# Altium project Tank.PrjPcb
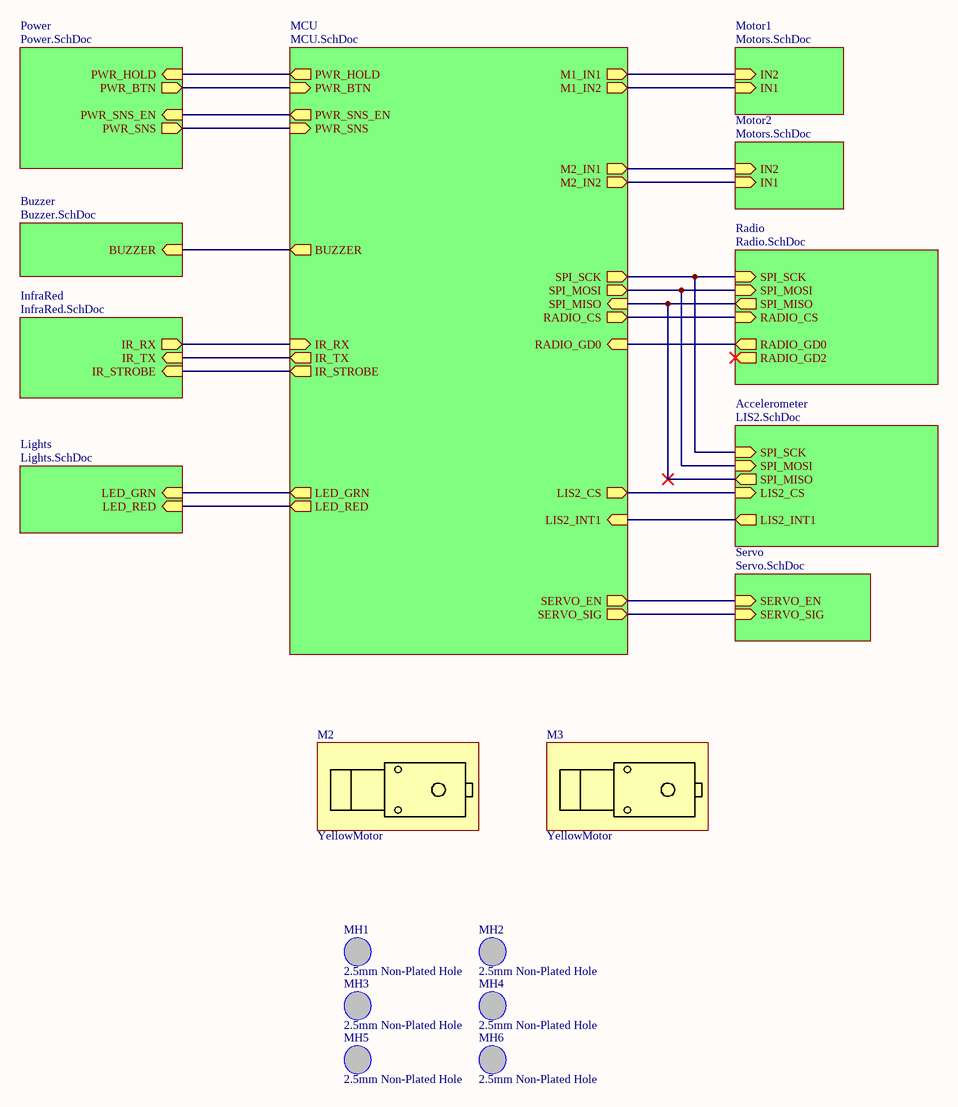
[diagram p0: Top.SchDoc]
Project_Revision: 1.0; Project_Board_Name: A7V Tank
10 sheets, 99 parts. Net scope: hierarchical (ports join the sheet entries above them; power ports are global).
Board file: Tank.PcbDoc
Sheets:
  Top.SchDoc
    Motor1 = Motors.SchDoc
    Motor2 = Motors.SchDoc
    Radio = Radio.SchDoc
    Power = Power.SchDoc
    MCU = MCU.SchDoc
    Servo = Servo.SchDoc
    Accelerometer = LIS2.SchDoc
    Buzzer = Buzzer.SchDoc
    InfraRed = InfraRed.SchDoc
    Lights = Lights.SchDoc

## Sheet Top.SchDoc: Top Level
size A3; CompanyName: NOT USED; DocumentNumber: 10; SheetNumber: 10; SheetTotal: 10; PageSetup: Record=PageOptions|CenterHorizontal=True|CenterVertical=True|PrintScale=1.00|XCorrection=1.00|YCorrection=1.00|PrintKind=0|BorderSize=5000000|LeftOffset=0|BottomOffset=0|Orientation=2|PaperLength=1000|PaperWidth=1000|Scale=100|PaperSource=7|PrintQuality=-4|MediaType=1|DitherType=10|PaperKind=A3|PrintScaleMode=0

### Parts
M2  YellowMotor  [YELLOW_MOTOR]
M3  YellowMotor  [YELLOW_MOTOR]
MH1  2.5mm Non-Plated Hole  [MTG250X550]  (no BOM)
MH2  2.5mm Non-Plated Hole  [MTG250X550]  (no BOM)
MH3  2.5mm Non-Plated Hole  [MTG250X550]  (no BOM)
MH4  2.5mm Non-Plated Hole  [MTG250X550]  (no BOM)
MH5  2.5mm Non-Plated Hole  [MTG250X550]  (no BOM)
MH6  2.5mm Non-Plated Hole  [MTG250X550]  (no BOM)

### Sub-sheets
Accelerometer = LIS2.SchDoc: SPI_MISO (out), LIS2_CS (in), LIS2_INT1 (out), SPI_SCK (in), SPI_MOSI (in)
Buzzer = Buzzer.SchDoc: BUZZER (in)
InfraRed = InfraRed.SchDoc: IR_RX (out), IR_TX (in), IR_STROBE (in)
Lights = Lights.SchDoc: LED_GRN (in), LED_RED (in)
MCU = MCU.SchDoc: RADIO_GD0 (in), M1_IN1 (out), IR_TX (out), PWR_BTN (in), M1_IN2 (out), LED_GRN (out), LED_RED (out), PWR_SNS_EN (out), PWR_SNS (in), IR_STROBE (out), BUZZER (out), M2_IN2 (out), RADIO_CS (out), IR_RX (in), PWR_HOLD (out), M2_IN1 (out), SERVO_SIG (out), SPI_SCK (out), SERVO_EN (out), SPI_MISO (in), SPI_MOSI (out), LIS2_CS (out), LIS2_INT1 (in)
Motor1 = Motors.SchDoc: IN2 (in), IN1 (in)
Motor2 = Motors.SchDoc: IN2 (in), IN1 (in)
Power = Power.SchDoc: PWR_HOLD (in), PWR_SNS_EN (in), PWR_BTN (out), PWR_SNS (out)
Radio = Radio.SchDoc: RADIO_CS (in), RADIO_GD0 (out), RADIO_GD2 (out), SPI_SCK (in), SPI_MISO (out), SPI_MOSI (in)
Servo = Servo.SchDoc: SERVO_SIG (in), SERVO_EN (in)

### Nets
IR_RX: sheet MCU/IR_RX, sheet InfraRed/IR_RX
IR_TX: sheet MCU/IR_TX, sheet InfraRed/IR_TX
NetD1_2: sheet Power/PWR_HOLD, sheet MCU/PWR_HOLD
NetQ1_1: sheet MCU/LED_GRN, sheet Lights/LED_GRN
NetQ2_1: sheet MCU/LED_RED, sheet Lights/LED_RED
NetQ4_1: sheet MCU/IR_STROBE, sheet InfraRed/IR_STROBE
NetQ5_1: sheet MCU/BUZZER, sheet Buzzer/BUZZER
NetQ7_1: sheet MCU/SERVO_EN, sheet Servo/SERVO_EN
NetR17_2: sheet MCU/SERVO_SIG, sheet Servo/SERVO_SIG
NetR18_1: sheet Power/PWR_SNS, sheet MCU/PWR_SNS
NetR20_1: sheet Power/PWR_BTN, sheet MCU/PWR_BTN
NetU4_1: sheet Radio/SPI_SCK, sheet MCU/SPI_SCK, sheet Accelerometer/SPI_SCK
NetU4_2: sheet Radio/SPI_MOSI, sheet MCU/SPI_MOSI, sheet Accelerometer/SPI_MOSI
NetU4_3: sheet Radio/SPI_MISO, sheet MCU/SPI_MISO, sheet Accelerometer/SPI_MISO
NetU4_4: sheet MCU/LIS2_CS, sheet Accelerometer/LIS2_CS
NetU4_6: sheet MCU/LIS2_INT1, sheet Accelerometer/LIS2_INT1
NetU5_4: sheet Power/PWR_SNS_EN, sheet MCU/PWR_SNS_EN
NetU6_6: sheet Motor2/IN1, sheet MCU/M2_IN2
NetU6_7: sheet Motor2/IN2, sheet MCU/M2_IN1
NetU6_8: sheet Motor1/IN1, sheet MCU/M1_IN2
NetU6_9: sheet Motor1/IN2, sheet MCU/M1_IN1
NetU6_14: sheet Radio/RADIO_GD0, sheet MCU/RADIO_GD0
NetU6_15: sheet Radio/RADIO_CS, sheet MCU/RADIO_CS

### Notes on the sheet
- Project
- Size:
- Date:
- A3
- Revision:
- Sheet
- of
- Lambo
- File:

### Library data of the parts
MH1-MH6 = NONPART-007: Display_Name: 2.5mm Non-Plated Hole; BWA PN: NONPART-007; Schematic Symbol: HOLE_UNPLATED

## Sheet Motors.SchDoc: Top Level
size A3; CompanyName: NOT USED; DocumentNumber: 9; SheetNumber: 9; SheetTotal: 10; PageSetup: Record=PageOptions|CenterHorizontal=True|CenterVertical=True|PrintScale=1.00|XCorrection=1.00|YCorrection=1.00|PrintKind=0|BorderSize=5000000|LeftOffset=0|BottomOffset=0|Orientation=2|PaperLength=1000|PaperWidth=1000|Scale=100|PaperSource=7|PrintQuality=-4|MediaType=1|DitherType=10|PaperKind=A3|PrintScaleMode=0
Used 2 times, as channels Motor1, Motor2. Parts and nets are listed once, with the designators drawn on the sheet.
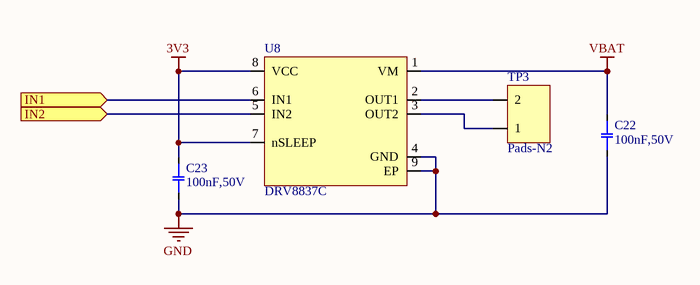
[diagram p1: Motors.SchDoc]

### Parts
C22  100nF,50V  [CAPC1608X09N_0603]
C23  100nF,50V  [CAPC1608X09N_0603]
TP3  Pads-N2  [PADS-N2]
U8  DRV8837C  [DFN50P200X200X80-8N]

### Ports
IN1 (in), IN2 (in)

### Nets
3V3: C23.2 U8.7(nSLEEP) U8.8(VCC)
GND: C22.1 C23.1 U8.4(GND) U8.9(EP)
VBAT: C22.2 U8.1(VM)
IN1: U8.6(IN1) ; port IN1
IN2: U8.5(IN2) ; port IN2
NetTP3_1: TP3.1 U8.3(OUT2)
NetTP3_2: TP3.2 U8.2(OUT1)

### Channels
Motor1: designators end in _1; ports IN1=NetU6_8 IN2=NetU6_9
Motor2: designators end in _2; ports IN1=NetU6_6 IN2=NetU6_7

### Notes on the sheet
- Project
- Size:
- Date:
- A3
- Revision:
- Sheet
- of
- Lambo
- File:

### Library data of the parts
C22 C23 = CCH-104CH-G: CAP CER 0.1UF 50V 10% X7R 0603; Manufacturer: Kemet; Manufacturer Part Number: C0603C104K5RACTU; Type: Ceramic; Display_Name: 100nF,50V; Capacitance: 100nF; Dielectric: X7R; Tolerance: 10%; Voltage: 50V; BWA PN: CCH-104CH-G; Schematic Symbol: CAP-NP_1; Supplier 1: Digi-Key; Supplier Part Number 1: 399-5089-1-ND
U8 = ICT-10892-A: IC HALF-BRIDGE DRVR PWM 8WSON; Manufacturer: Texas Instruments; Manufacturer Part Number: DRV8837CDSGR; Temp Range: -40°C ~ 85°C; Display_Name: DRV8837C; BWA PN: ICT-10892-A; Schematic Symbol: DRV8837C; Supplier 1: Digi-Key; Supplier Part Number 1: 296-47205-1-ND

## Sheet Radio.SchDoc: Top Level
size A3; CompanyName: NOT USED; DocumentNumber: 8; SheetNumber: 8; SheetTotal: 10; PageSetup: Record=PageOptions|CenterHorizontal=True|CenterVertical=True|PrintScale=1.00|XCorrection=1.00|YCorrection=1.00|PrintKind=0|BorderSize=5000000|LeftOffset=0|BottomOffset=0|Orientation=2|PaperLength=1000|PaperWidth=1000|Scale=100|PaperSource=7|PrintQuality=-4|MediaType=1|DitherType=10|PaperKind=A3|PrintScaleMode=0
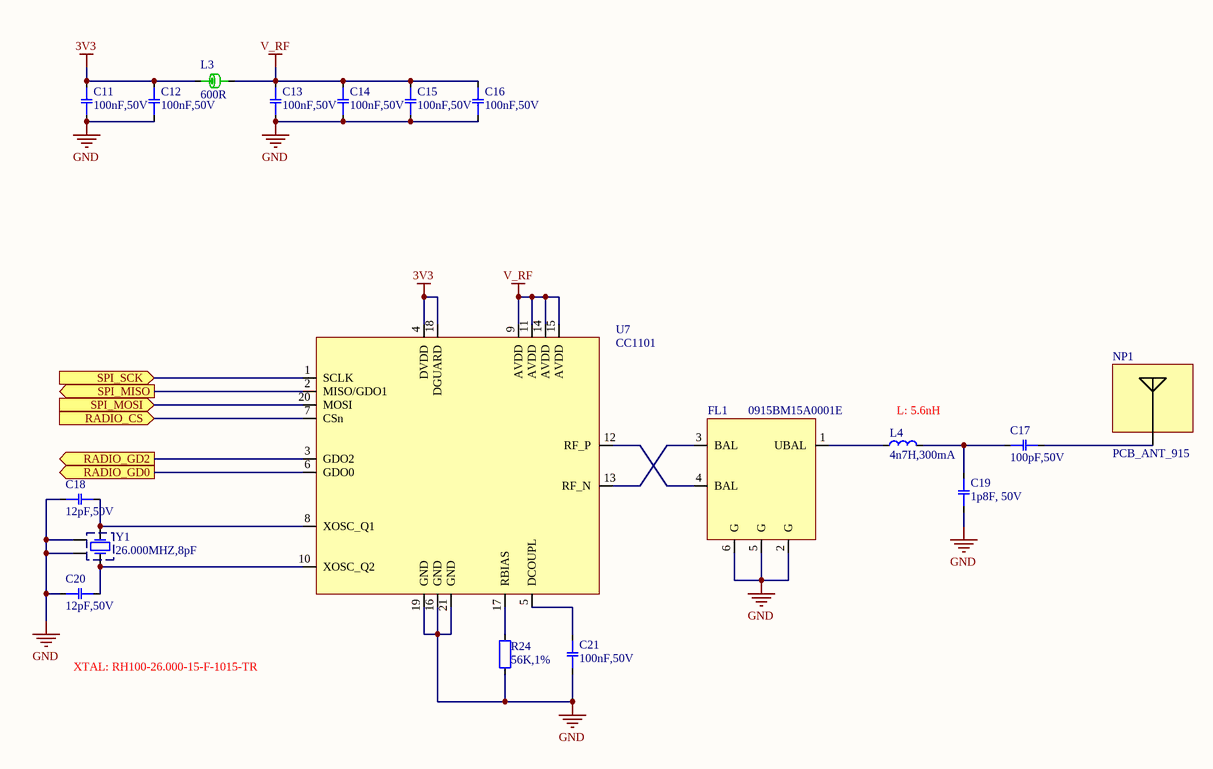
[diagram p2: Radio.SchDoc]

### Parts
C11  100nF,50V  [CAPC1005X05N_0402]
C12  100nF,50V  [CAPC1005X05N_0402]
C13  100nF,50V  [CAPC1005X05N_0402]
C14  100nF,50V  [CAPC1005X05N_0402]
C15  100nF,50V  [CAPC1005X05N_0402]
C16  100nF,50V  [CAPC1005X05N_0402]
C17  100pF,50V  [CAPC1005X05N_0402]
C18  12pF,50V  [CAPC1005X05N_0402]
C19  1p8F, 50V  [CAPC1005X05N_0402]
C20  12pF,50V  [CAPC1005X05N_0402]
C21  100nF,50V  [CAPC1005X05N_0402]
FL1  0915BM15A0001E  [FLTR65P200X125-6N_0805]
L3  600R  [INDC1608X10N_0603]
L4  4n7H,300mA  [INDC1005X04N_0402]
NP1  PCB_ANT_915  [ANT_PCB_915]
R24  56K,1%  [RESC1005X04N_0402]
U7  CC1101  [QFN50P400X400X75-20N_20QFN]
Y1  26.000MHZ,8pF  [XTAL_NX3225SA]

### Ports
RADIO_CS (in), RADIO_GD0 (out), RADIO_GD2 (out), SPI_MISO (out), SPI_MOSI (in), SPI_SCK (in)

### Nets
3V3: C11.2 C12.2 L3.1 U7.4(DVDD) U7.18(DGUARD)
GND: C11.1 C12.1 C13.1 C14.1 C15.1 C16.1 C18.1 C19.1 C20.1 C21.1 FL1.2(G) FL1.5(G) FL1.6(G) R24.1 U7.16(GND) U7.19(GND) U7.21(GND) Y1.2 Y1.4
V_RF: C13.2 C14.2 C15.2 C16.2 L3.2 U7.9(AVDD) U7.11(AVDD) U7.14(AVDD) U7.15(AVDD)
NetC17_1: C17.1 C19.2 L4.2
NetC17_2: C17.2 NP1.1(ANT)
NetC18_2: C18.2 U7.8(XOSC_Q1) Y1.1
NetC20_2: C20.2 U7.10(XOSC_Q2) Y1.3
NetC21_2: C21.2 U7.5(DCOUPL)
NetFL1_1: FL1.1(UBAL) L4.1
NetFL1_3: FL1.3(BAL) U7.13(RF_N)
NetFL1_4: FL1.4(BAL) U7.12(RF_P)
NetR24_2: R24.2 U7.17(RBIAS)
NetU4_1: U7.1(SCLK) ; port SPI_SCK
NetU4_2: U7.20(MOSI) ; port SPI_MOSI
NetU4_3: U7.2(MISO/GDO1) ; port SPI_MISO
NetU6_14: U7.6(GDO0) ; port RADIO_GD0
NetU6_15: U7.7(CSn) ; port RADIO_CS
NetU7_3: U7.3(GDO2) ; port RADIO_GD2

### Notes on the sheet
- (near L4) L: 5.6nH
- XTAL: RH100-26.000-15-F-1015-TR
- Project
- Size:
- Date:
- A3
- Revision:
- Sheet
- of
- Lambo
- File:

### Library data of the parts
C11-C16 C21 = CCG-104DE-H: CAP CER 0.1UF 50V X7R 0402; Manufacturer: Taiyo Yuden; Manufacturer Part Number: UMK105B7104KV-FR; Tolerance: 10%; Type: Ceramic; Display_Name: 100nF,50V; Capacitance: 100nF; Dielectric: X7R; Voltage: 50V; BWA PN: CCG-104DE-H; Schematic Symbol: CAP-NP_1; Supplier 1: Digi-Key; Supplier Part Number 1: 587-3498-1-ND
C17 = CCG-101PAH-F: CAP CER 100PF 50V 5% NP0 0402; Manufacturer: Murata Electronics North America; Manufacturer Part Number: GRM1555C1H101JA01D; Dielectric: NPO; Type: Ceramic; Display_Name: 100pF,50V; Capacitance: 100pF; Tolerance: 5%; Voltage: 50V; BWA PN: CCG-101PAH-F; Schematic Symbol: CAP-NP_1; Supplier 1: Digi-Key; Supplier Part Number 1: 490-5922-1-ND
C18 C20 = CCG-12PAH-F: CAP CER 12PF 50V 5% NP0 0402; Manufacturer: Murata Electronics North America; Manufacturer Part Number: GRM1555C1H120JA01D; Dielectric: NPO; Type: Ceramic; Display_Name: 12pF,50V; Capacitance: 12pF; Tolerance: 5%; Voltage: 50V; BWA PN: CCG-12PAH-F; Schematic Symbol: CAP-NP_1; Supplier 1: Digi-Key; Supplier Part Number 1: 490-5924-1-ND
C19 = CCG-1P8AH-F: CAP CER 1.8PF 50V C0G/NP0 0402; Manufacturer: Murata Electronics North America; Manufacturer Part Number: GJM1555C1H1R8BB01D; Dielectric: Ceramic; Tolerance: ±0.1pF; Display_Name: 1p8F, 50V; Capacitance: 1p8F; Type: C0G/NP0; Voltage: 50V; BWA PN: CCG-1P8AH-F; Schematic Symbol: CAP-NP_1; Supplier 1: Digi-Key; Supplier Part Number 1: 490-8089-1-ND
FL1 = ICT-10614-A: BALUN 902MHZ-928MHZ 0805; Manufacturer: Johanson Technology Inc; Display_Name: 0915BM15A0001E; BWA PN: ICT-10614-A; Schematic Symbol: ____BM15A0001E; Manufacturer Part Number: 0915BM15A0001E; Supplier 1: Digi-Key; Supplier Part Number 1: 712-1541-1-ND
L3 = IND-10163-A: FERRITE BEAD 600 OHM 0603 1LN; Manufacturer: Wurth Electronics Inc; Manufacturer Part Number: 742792651; Inductance: 600Ohm @ 100MHz; Current Rating: 1A; DC Resistance: 200mOhm; Schematic Symbol: INDUCTOR_1; Display_Name: 600R; BWA PN: IND-10163-A; Supplier 1: Digi-Key; Supplier Part Number 1: 732-1593-1-ND
L4 = IND-10145-A: INDUCTOR 4.7NH 300MA 0402; Manufacturer: Murata Electronics North America; Manufacturer Part Number: LQG15HS4N7S02D; Sheilding: Unshielded; Type: Air; DC Resistance: 180mOhm; Display_Name: 4n7H,300mA; Inductance: 4n7H; BWA PN: IND-10145-A; Current Rating: 300mA; Schematic Symbol: INDUCTOR_1; Supplier 1: Digi-Key; Supplier Part Number 1: 490-2618-1-ND
R24 = RSG-56K00-D: RES 56.0K OHM 1/16W 1% 0402 SMD; Manufacturer: Yageo; Manufacturer Part Number: RC0402FR-0756KL; Power: 0.063W; Display_Name: 56K,1%; Resistance: 56K; Tolerance: 1%; Type: Chip; BWA PN: RSG-56K00-D; Schematic Symbol: RESISTOR_1; Supplier 1: Digi-Key; Supplier Part Number 1: 311-56.0KLRCT-ND
U7 = ICT-10885-A: IC RF TXRX ISM<1GHZ 20VFQFN; Manufacturer: Texas Instruments; Manufacturer Part Number: CC1101RGPR; Temp Range: -40°C ~ 85°C; Display_Name: CC1101; BWA PN: ICT-10885-A; Schematic Symbol: CC1101; Supplier 1: Digi-Key; Supplier Part Number 1: 296-35718-1-ND
Y1 = XTL-10058-A: CRYSTAL 26MHZ 8PF SMD; Manufacturer: NDK; Manufacturer Part Number: NX3225SA-26.000000MHZ-STD-CSR-1; Accuracy: ±15ppm; Display_Name: 26.000MHZ,8pF; Frequency: 26MHz; Type: Fundamental; BWA PN: XTL-10058-A; Load Capacitance: 8pF; Schematic Symbol: XTAL_2; Supplier 1: Digi-Key; Supplier Part Number 1: 644-1054-1-ND

## Sheet Power.SchDoc: Top Level
size A3; CompanyName: NOT USED; DocumentNumber: 6; SheetNumber: 6; SheetTotal: 10; PageSetup: Record=PageOptions|CenterHorizontal=True|CenterVertical=True|PrintScale=1.00|XCorrection=1.00|YCorrection=1.00|PrintKind=0|BorderSize=5000000|LeftOffset=0|BottomOffset=0|Orientation=2|PaperLength=1000|PaperWidth=1000|Scale=100|PaperSource=7|PrintQuality=-4|MediaType=1|DitherType=10|PaperKind=A3|PrintScaleMode=0
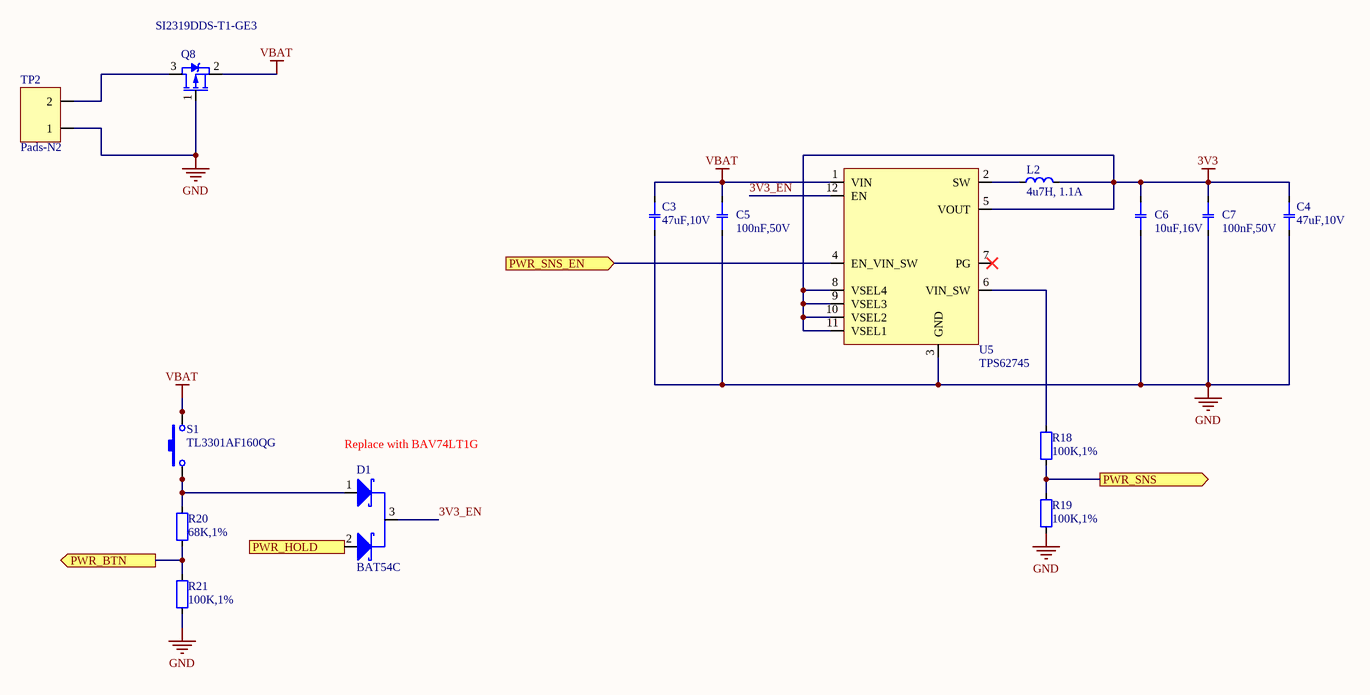
[diagram p3: Power.SchDoc]

### Parts
C3  47uF,10V  [CAPC2012X12N_0805]
C4  47uF,10V  [CAPC2012X12N_0805]
C5  100nF,50V  [CAPC1608X09N_0603]
C6  10uF,16V  [CAPC2012X12N_0805]
C7  100nF,50V  [CAPC1608X09N_0603]
D1  BAT54C  [SOT95P237X111-3N_SOT23]
L2  4u7H, 1.1A  [INDC2520X12N_1008]
Q8  SI2319DDS-T1-GE3  [SOT95P230X110-3N_SOT23]
R18  100K,1%  [RESC1608X06N_0603]
R19  100K,1%  [RESC1608X06N_0603]
R20  68K,1%  [RESC1608X06N_0603]
R21  100K,1%  [RESC1608X06N_0603]
S1  TL3301AF160QG  [SW_TL3301AFXXXXG]
TP2  Pads-N2  [PADS-N2]
U5  TPS62745  [R-PWSON-N12]

### Ports
PWR_BTN (out), PWR_HOLD (in), PWR_SNS (out), PWR_SNS_EN (in)

### Nets
3V3: C4.1 C6.2 C7.2 L2.2 U5.5(VOUT) U5.8(VSEL4) U5.9(VSEL3) U5.10(VSEL2) U5.11(VSEL1)
GND: C3.2 C4.2 C5.1 C6.1 C7.1 Q8.1(G) R19.1 R21.2 TP2.1 U5.3(GND)
VBAT: C3.1 C5.2 Q8.2(S) S1.3 S1.4 U5.1(VIN)
3V3_EN: D1.3(C1/C2) U5.12(EN)
NetD1_1: D1.1(A1) R20.2 S1.1 S1.2
NetD1_2: D1.2(A2) ; port PWR_HOLD
NetL2_1: L2.1 U5.2(SW)
NetQ8_3: Q8.3(D) TP2.2
NetR18_1: R18.1 R19.2 ; port PWR_SNS
NetR18_2: R18.2 U5.6(VIN_SW)
NetR20_1: R20.1 R21.1 ; port PWR_BTN
NetU5_4: U5.4(EN_VIN_SW) ; port PWR_SNS_EN

Not connected (* = marked no-connect by the designer): U5 7(PG)*

### Notes on the sheet
- (near D1) Replace with BAV74LT1G
- Project
- Size:
- Date:
- A3
- Revision:
- Sheet
- of
- Lambo
- File:

### Library data of the parts
C3 C4 = CCI-476DD-H: CAP CER 47UF 10V 20% X5R 0805; Manufacturer: TDK Corporation; Manufacturer Part Number: C2012X5R1A476M125AC; Type: Ceramic; Display_Name: 47uF,10V; Capacitance: 47uF; Dielectric: X5R; Tolerance: 20%; Voltage: 10V; BWA PN: CCI-476DD-H; Schematic Symbol: CAP-NP_1; Supplier 1: Digi-Key; Supplier Part Number 1: 445-8239-1-ND
C5 C7 = CCH-104CH-G: as C22 on sheet Motors; Display_Name: 100nF,50V; Capacitance: 100nF; Dielectric: X7R; Tolerance: 10%; Voltage: 50V; BWA PN: CCH-104CH-G; Schematic Symbol: CAP-NP_1; Supplier 1: Digi-Key; Supplier Part Number 1: 399-5089-1-ND
C6 = CCI-106CD-G: CAP CER 10µF ±10% 16V X7R 0805; Manufacturer: Samsung Electro-Mechanics America, Inc.; Manufacturer Part Number: CL21B106KOQNNNG; Type: Ceramic; Display_Name: 10uF,16V; Capacitance: 10uF; Dielectric: X7R; Tolerance: 10%; Voltage: 16V; BWA PN: CCI-106CD-G; Schematic Symbol: CAP-NP_1; Supplier 1: Digi-Key; Supplier Part Number 1: 1276-6472-1-ND
D1 = DIO-10192-A: DIODE ARRAY SCHOTTKY 30V SOT23-3; Manufacturer: Fairchild/ON Semiconductor; Vf@I: 800mV @ 100mA; d_if(max): 200mA; Display_Name: BAT54C; Type: Schottky; BWA PN: DIO-10192-A; Vr(max): 30V; Schematic Symbol: BAT54C; Manufacturer Part Number: BAT54C; Supplier 1: Digi-Key; Supplier Part Number 1: BAT54CFSCT-ND
L2 = IND-10165-A: INDUCTOR POWER 4.7UH 1.1A SMD; Manufacturer: Murata Electronics North America; Manufacturer Part Number: DFE252010R-H-4R7M=P2; Sheilding: Unsheilded; Type: Wirewound; DC Resistance: 276mOhm; Display_Name: 4u7H, 1.1A; Inductance: 4u7H; BWA PN: IND-10165-A; Current Rating: 1.1A; Schematic Symbol: INDUCTOR_1; Supplier 1: Digi-Key; Supplier Part Number 1: 490-10646-1-ND
Q8 = TRN-10117-A: MOSFET P-CHAN 40V; Manufacturer: Vishay Siliconix; Type: P; Id(max): 2.7A (Ta), 3.6A (Tc); rds(on): 75mOhm @ 2.7A, 10V; Vgs(max): ±20V; Vth(max): 2.5V @ 250µA; Display_Name: SI2319DDS-T1-GE3; BWA PN: TRN-10117-A; Vds(max): 40V; Schematic Symbol: MOSFET-P_1; Manufacturer Part Number: SI2319DDS-T1-GE3; Supplier 1: Digi-Key; Supplier Part Number 1: SI2319DDS-T1-GE3CT-ND
R18 R19 R21 = RSH-100K0-D: RES 100K OHM 1/10W 1% 0603 SMD; Manufacturer: Yageo; Manufacturer Part Number: RC0603FR-07100KL; Power: 0.1W; Display_Name: 100K,1%; Resistance: 100K; Tolerance: 1%; Type: Chip; BWA PN: RSH-100K0-D; Schematic Symbol: RESISTOR_1; Supplier 1: Digi-Key; Supplier Part Number 1: 311-100KHRCT-ND
R20 = RSH-68K00-D: RES 68K OHM 1/10W 1% 0603 SMD; Manufacturer: Yageo; Manufacturer Part Number: RC0603FR-0768KL; Power: 0.1W; Display_Name: 68K,1%; Resistance: 68K; Tolerance: 1%; Type: Chip; BWA PN: RSH-68K00-D; Schematic Symbol: RESISTOR_1; Supplier 1: Digi-Key; Supplier Part Number 1: 311-68.0KHRCT-ND
S1 = SWT-10009-A: SWITCH TACT 160GF H=5.0MM SMT; Manufacturer: E-Switch; Circuit: SPST-NO; Function: Off-Mom; Display_Name: TL3301AF160QG; Type: Tactile; BWA PN: SWT-10009-A; Schematic Symbol: SW_SPST_2; Manufacturer Part Number: TL3301AF160QG; Supplier 1: Digi-Key; Supplier Part Number 1: EG2526CT-ND
U5 = ICT-10699-A: Step Down Converter; Manufacturer: Texas Instruments; Temp Range: -40°C ~ 85°C; Display_Name: TPS62745; BWA PN: ICT-10699-A; Schematic Symbol: TPS62745; Manufacturer Part Number: TPS62745; Supplier 1: Digi-Key; Supplier Part Number 1: 296-44339-1-ND; Supplier 2: Element 14; Supplier Part Number 2: 2498474

## Sheet MCU.SchDoc: Top Level
size A3; CompanyName: NOT USED; DocumentNumber: 7; SheetNumber: 7; SheetTotal: 10; PageSetup: Record=PageOptions|CenterHorizontal=True|CenterVertical=True|PrintScale=1.00|XCorrection=1.00|YCorrection=1.00|PrintKind=0|BorderSize=5000000|LeftOffset=0|BottomOffset=0|Orientation=2|PaperLength=1000|PaperWidth=1000|Scale=100|PaperSource=7|PrintQuality=-4|MediaType=1|DitherType=10|PaperKind=A3|PrintScaleMode=0
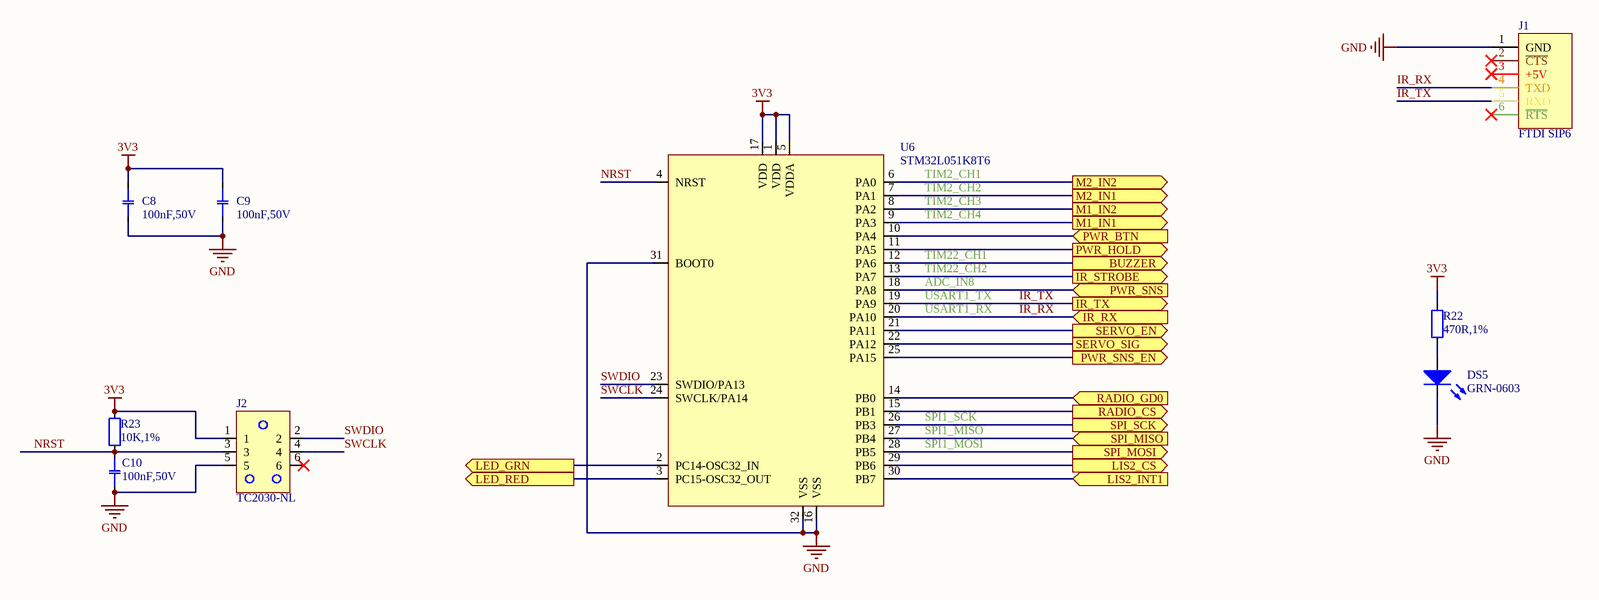
[diagram p4: MCU.SchDoc]

### Parts
C8  100nF,50V  [CAPC1608X09N_0603]
C9  100nF,50V  [CAPC1608X09N_0603]
C10  100nF,50V  [CAPC1608X09N_0603]
DS5  GRN-0603  [LED_SML-LX0603]
J1  FTDI SIP6  [HIROSE_A2-6PA-2.54DSA]
J2  TC2030-NL  [TAGCON_TC2030-IDC-NL]  (no BOM)
R22  470R,1%  [RESC1608X06N_0603]
R23  10K,1%  [RESC1608X06N_0603]
U6  STM32L051K8T6  [LQFP32]

### Ports
BUZZER (out), IR_RX (in), IR_STROBE (out), IR_TX (out), LED_GRN (out), LED_RED (out), LIS2_CS (out), LIS2_INT1 (in), M1_IN1 (out), M1_IN2 (out), M2_IN1 (out), M2_IN2 (out), PWR_BTN (in), PWR_HOLD (out), PWR_SNS (in), PWR_SNS_EN (out), RADIO_CS (out), RADIO_GD0 (in), SERVO_EN (out), SERVO_SIG (out), SPI_MISO (in), SPI_MOSI (out), SPI_SCK (out)

### Nets
3V3: C8.2 C9.2 J2.1 R22.2 R23.2 U6.1(VDD) U6.5(VDDA) U6.17(VDD)
GND: C8.1 C9.1 C10.2 DS5.1(C) J1.1(GND) J2.5 U6.16(VSS) U6.31(BOOT0) U6.32(VSS)
IR_RX: J1.4(TXD) U6.20(PA10) ; port IR_RX
IR_TX: J1.5(RXD) U6.19(PA9) ; port IR_TX
NRST: C10.1 J2.3 R23.1 U6.4(NRST)
SWCLK: J2.4 U6.24(SWCLK/PA14)
SWDIO: J2.2 U6.23(SWDIO/PA13)
NetD1_2: U6.11(PA5) ; port PWR_HOLD
NetDS5_2: DS5.2(A) R22.1
NetQ1_1: U6.2(PC14-OSC32_IN) ; port LED_GRN
NetQ2_1: U6.3(PC15-OSC32_OUT) ; port LED_RED
NetQ4_1: U6.13(PA7) ; port IR_STROBE
NetQ5_1: U6.12(PA6) ; port BUZZER
NetQ7_1: U6.21(PA11) ; port SERVO_EN
NetR17_2: U6.22(PA12) ; port SERVO_SIG
NetR18_1: U6.18(PA8) ; port PWR_SNS
NetR20_1: U6.10(PA4) ; port PWR_BTN
NetU4_1: U6.26(PB3) ; port SPI_SCK
NetU4_2: U6.28(PB5) ; port SPI_MOSI
NetU4_3: U6.27(PB4) ; port SPI_MISO
NetU4_4: U6.29(PB6) ; port LIS2_CS
NetU4_6: U6.30(PB7) ; port LIS2_INT1
NetU5_4: U6.25(PA15) ; port PWR_SNS_EN
NetU6_6: U6.6(PA0) ; port M2_IN2
NetU6_7: U6.7(PA1) ; port M2_IN1
NetU6_8: U6.8(PA2) ; port M1_IN2
NetU6_9: U6.9(PA3) ; port M1_IN1
NetU6_14: U6.14(PB0) ; port RADIO_GD0
NetU6_15: U6.15(PB1) ; port RADIO_CS

Not connected (* = marked no-connect by the designer): J1 2(~{CTS})* 3(+5V)* 6(~{RTS})*; J2 6*

### Notes on the sheet
- (near U6) TIM2_CH1
- (near U6) TIM2_CH2
- (near U6) TIM2_CH3
- (near U6) TIM2_CH4
- (near U6) USART1_TX
- (near U6) ADC_IN8
- (near U6) TIM22_CH1
- (near U6) TIM22_CH2
- (near U6) USART1_RX
- (near U6) SPI1_SCK
- (near U6) SPI1_MISO
- (near U6) SPI1_MOSI
- Project
- Size:
- Date:
- A3
- Revision:
- Sheet
- of
- Lambo
- File:

### Library data of the parts
C8-C10 = CCH-104CH-G: as C22 on sheet Motors; Display_Name: 100nF,50V; Capacitance: 100nF; Dielectric: X7R; Tolerance: 10%; Voltage: 50V; BWA PN: CCH-104CH-G; Schematic Symbol: CAP-NP_1; Supplier 1: Digi-Key; Supplier Part Number 1: 399-5089-1-ND
DS5 = LED-10087-A: LED GREEN CLEAR 0603 SMD; Manufacturer: Dialight; Manufacturer Part Number: 5988081107F; Wavelength: 523nm; Axial Intensity: 300mcd; If(max): 20mA; Lens Style/Size: 0603; Vf@I: 3.2V; Viewing Angle: 140; Display_Name: GRN-0603; BWA PN: LED-10087-A; Colour: GREEN; Lens type: clear; Vr(max): -; Schematic Symbol: LED_1; Supplier 1: Digi-Key; Supplier Part Number 1: 350-2036-1-ND
J1 = CON-10749-A: FTDI Serial Header; Manufacturer: Hirose Electric Co Ltd; Manufacturer Part Number: A2-6PA-2.54DSA(71); Contacts: 6; Pitch: 2.54mm; Rows: 1; Display_Name: FTDI SIP6; Type: Header; BWA PN: CON-10749-A; Schematic Symbol: FTDI_TTL_232R; Supplier 1: Digi-Key; Supplier Part Number 1: H123043-ND
J2 = NONPART-056: Tag connect 6 way - No Legs; Display_Name: TC2030-NL; BWA PN: NONPART-056; Schematic Symbol: TAGCON_TC2030-IDC
R22 = RSH-470R0-D: RES 470 OHM 1/10W 1% 0603 SMD; Manufacturer: Rohm Semiconductor; Manufacturer Part Number: MCR03EZPFX4700; Power: 0.1W; Display_Name: 470R,1%; Resistance: 470R; Tolerance: 1%; Type: Chip; BWA PN: RSH-470R0-D; Schematic Symbol: RESISTOR_1; Supplier 1: Digi-Key; Supplier Part Number 1: RHM470HCT-ND
R23 = RSH-10K00-D: RES 10.0K OHM 1/10W 1% 0603 SMD; Manufacturer: Yageo; Manufacturer Part Number: RC0603FR-0710KL; Power: 0.1W; Display_Name: 10K,1%; Resistance: 10K; Tolerance: 1%; Type: Chip; BWA PN: RSH-10K00-D; Schematic Symbol: RESISTOR_1; Supplier 1: Digi-Key; Supplier Part Number 1: 311-10.0KHRCT-ND
U6 = ICT-10696-A: 32 Bit Mcirocontroler; Manufacturer: ST Microelectronics; Temp Range: -40°C ~ 85°C; Display_Name: STM32L051K8T6; BWA PN: ICT-10696-A; Schematic Symbol: STM32L051x6/8; Manufacturer Part Number: STM32L051K8T6; Supplier 1: Digi-Key; Supplier Part Number 1: 497-14901-ND

## Sheet Servo.SchDoc: Top Level
size A3; CompanyName: NOT USED; DocumentNumber: 5; SheetNumber: 5; SheetTotal: 10; PageSetup: Record=PageOptions|CenterHorizontal=True|CenterVertical=True|PrintScale=1.00|XCorrection=1.00|YCorrection=1.00|PrintKind=0|BorderSize=5000000|LeftOffset=0|BottomOffset=0|Orientation=2|PaperLength=1000|PaperWidth=1000|Scale=100|PaperSource=7|PrintQuality=-4|MediaType=1|DitherType=10|PaperKind=A3|PrintScaleMode=0
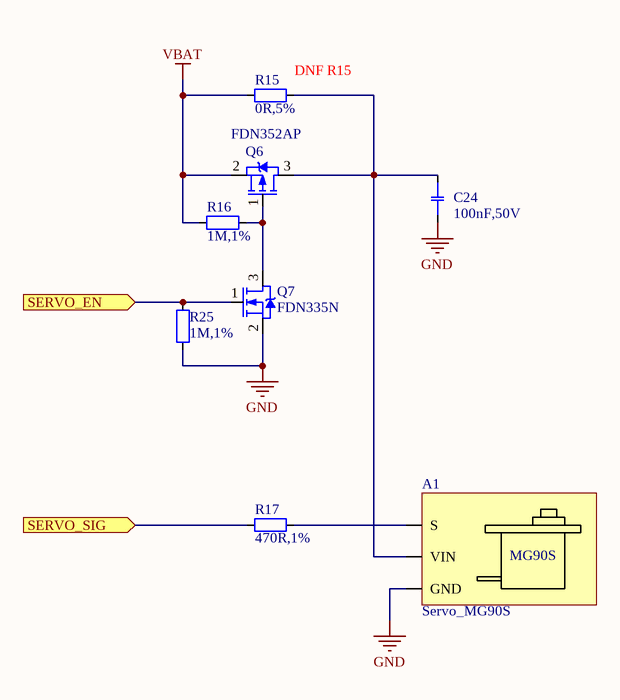
[diagram p5: Servo.SchDoc]

### Parts
A1  Servo_MG90S  [SERVO_MG90S]
C24  100nF,50V  [CAPC1608X09N_0603]
Q6  FDN352AP  [SOT95P230X110-3N_SOT23]
Q7  FDN335N  [SOT95P230X110-3N_SOT23]
R15  0R,5%  [RESC1608X06N_0603]
R16  1M,1%  [RESC1608X06N_0603]
R17  470R,1%  [RESC1608X06N_0603]
R25  1M,1%  [RESC1608X06N_0603]

### Ports
SERVO_EN (in), SERVO_SIG (in)

### Nets
GND: A1.1(GND) C24.1 Q7.2(S) R25.2
VBAT: Q6.2(S) R15.1 R16.2
NetA1_2: A1.2(VIN) C24.2 Q6.3(D) R15.2
NetA1_3: A1.3(S) R17.1
NetQ6_1: Q6.1(G) Q7.3(D) R16.1
NetQ7_1: Q7.1(G) R25.1 ; port SERVO_EN
NetR17_2: R17.2 ; port SERVO_SIG

### Notes on the sheet
- (near R15) DNF R15
- Project
- Size:
- Date:
- A3
- Revision:
- Sheet
- of
- Lambo
- File:
- (in symbol Servo_MG90S) MG90S

### Library data of the parts
C24 = CCH-104CH-G: as C22 on sheet Motors; Display_Name: 100nF,50V; Capacitance: 100nF; Dielectric: X7R; Tolerance: 10%; Voltage: 50V; BWA PN: CCH-104CH-G; Schematic Symbol: CAP-NP_1; Supplier 1: Digi-Key; Supplier Part Number 1: 399-5089-1-ND
Q6 = TRN-10006-A: MOSFET P-CH 30V 1.3A SSOT-3; Manufacturer: Fairchild; Type: P; Id(max): -1.3A; rds(on): 180mOhms; Vds(max): -30V; Vgs(max): +/-25V; Vth(max): -2.5V; Display_Name: FDN352AP; BWA PN: TRN-10006-A; Schematic Symbol: MOSFET-P_1; Manufacturer Part Number: FDN352AP; Supplier 1: Digi-Key; Supplier Part Number 1: FDN352APCT-ND
Q7 = TRN-10045-A: MOSFET N-CH 20V 1.7A SSOT3; Manufacturer: Fairchild Semiconductor; Type: N; rds(on): 70mOhm; Vgs(max): +/-8V; Vth(max): 1.5V; Display_Name: FDN335N; BWA PN: TRN-10045-A; Id(max): 1.7A; Vds(max): 20V; Schematic Symbol: MOSFET-N_1; Manufacturer Part Number: FDN335N; Supplier 1: Digi-Key; Supplier Part Number 1: FDN335NCT-ND
R15 = RSH-0R000-F: RES 0.0 OHM 1/10W 0603 SMD; Manufacturer: Yageo; Manufacturer Part Number: RC0603JR-070RL; Power: 0.1W; Display_Name: 0R,5%; Resistance: 0R; Tolerance: 5%; Type: Chip; BWA PN: RSH-0R000-F; Schematic Symbol: RESISTOR_1; Supplier 1: Digi-Key; Supplier Part Number 1: 311-0.0GRCT-ND
R16 R25 = RSH-1M000-D: RES 1.00M OHM 1/10W 1% 0603 SMD; Manufacturer: Yageo; Manufacturer Part Number: RC0603FR-071ML; Power: 0.1W; Display_Name: 1M,1%; Resistance: 1M; Tolerance: 1%; Type: Chip; BWA PN: RSH-1M000-D; Schematic Symbol: RESISTOR_1; Supplier 1: Digi-Key; Supplier Part Number 1: 311-1.00MHRCT-ND
R17 = RSH-470R0-D: as R22 on sheet MCU; Display_Name: 470R,1%; Resistance: 470R; Tolerance: 1%; Type: Chip; BWA PN: RSH-470R0-D; Schematic Symbol: RESISTOR_1; Supplier 1: Digi-Key; Supplier Part Number 1: RHM470HCT-ND

## Sheet LIS2.SchDoc: Top Level
size A3; CompanyName: NOT USED; DocumentNumber: 3; SheetNumber: 3; SheetTotal: 10; PageSetup: Record=PageOptions|CenterHorizontal=True|CenterVertical=True|PrintScale=1.00|XCorrection=1.00|YCorrection=1.00|PrintKind=0|BorderSize=5000000|LeftOffset=0|BottomOffset=0|Orientation=2|PaperLength=1000|PaperWidth=1000|Scale=100|PaperSource=7|PrintQuality=-4|MediaType=1|DitherType=10|PaperKind=A3|PrintScaleMode=0
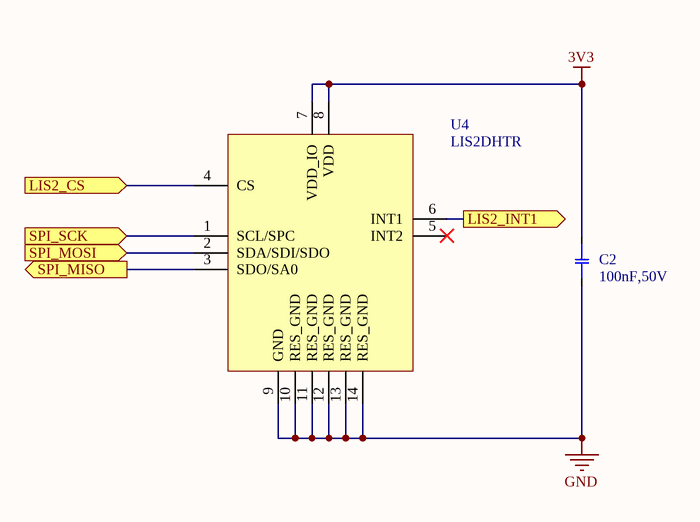
[diagram p6: LIS2.SchDoc]

### Parts
C2  100nF,50V  [CAPC1608X09N_0603]
U4  LIS2DHTR  [PQFN35P200X200X100-14N]

### Ports
LIS2_CS (in), LIS2_INT1 (out), SPI_MISO (out), SPI_MOSI (in), SPI_SCK (in)

### Nets
3V3: C2.2 U4.7(VDD_IO) U4.8(VDD)
GND: C2.1 U4.9(GND) U4.10(RES_GND) U4.11(RES_GND) U4.12(RES_GND) U4.13(RES_GND) U4.14(RES_GND)
NetU4_1: U4.1(SCL/SPC) ; port SPI_SCK
NetU4_2: U4.2(SDA/SDI/SDO) ; port SPI_MOSI
NetU4_3: U4.3(SDO/SA0) ; port SPI_MISO
NetU4_4: U4.4(CS) ; port LIS2_CS
NetU4_6: U4.6(INT1) ; port LIS2_INT1

Not connected (* = marked no-connect by the designer): U4 5(INT2)*

### Notes on the sheet
- Project
- Size:
- Date:
- A3
- Revision:
- Sheet
- of
- Lambo
- File:

### Library data of the parts
C2 = CCH-104CH-G: as C22 on sheet Motors; Display_Name: 100nF,50V; Capacitance: 100nF; Dielectric: X7R; Tolerance: 10%; Voltage: 50V; BWA PN: CCH-104CH-G; Schematic Symbol: CAP-NP_1; Supplier 1: Digi-Key; Supplier Part Number 1: 399-5089-1-ND
U4 = ICT-10655-A: IC ACCELEROMETER I2C/SPI 14-LGA; Manufacturer: STMicroelectronics; Temp Range: -40°C ~ 85°C; Display_Name: LIS2DHTR; BWA PN: ICT-10655-A; Schematic Symbol: LIS2DHTR; Manufacturer Part Number: LIS2DHTR; Supplier 1: Digi-Key; Supplier Part Number 1: 497-13795-1-ND

## Sheet Buzzer.SchDoc: Top Level
size A3; CompanyName: NOT USED; DocumentNumber: 4; SheetNumber: 4; SheetTotal: 10; PageSetup: Record=PageOptions|CenterHorizontal=True|CenterVertical=True|PrintScale=1.00|XCorrection=1.00|YCorrection=1.00|PrintKind=0|BorderSize=5000000|LeftOffset=0|BottomOffset=0|Orientation=2|PaperLength=1000|PaperWidth=1000|Scale=100|PaperSource=7|PrintQuality=-4|MediaType=1|DitherType=10|PaperKind=A3|PrintScaleMode=0
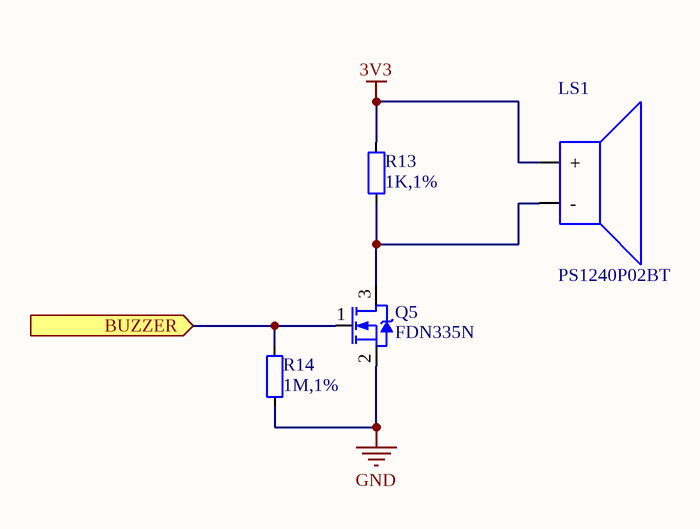
[diagram p7: Buzzer.SchDoc]

### Parts
LS1  PS1240P02BT  [SPKR_PS1240P02BT]
Q5  FDN335N  [SOT95P230X110-3N_SOT23]
R13  1K,1%  [RESC1608X06N_0603]
R14  1M,1%  [RESC1608X06N_0603]

### Ports
BUZZER (in)

### Nets
3V3: LS1.1(+) R13.2
GND: Q5.2(S) R14.2
NetLS1_2: LS1.2(-) Q5.3(D) R13.1
NetQ5_1: Q5.1(G) R14.1 ; port BUZZER

### Notes on the sheet
- Project
- Size:
- Date:
- A3
- Revision:
- Sheet
- of
- Lambo
- File:

### Library data of the parts
LS1 = SPK-10003-A: BUZZER PIEZO 4KHZ 12.2MM PC MNT; Manufacturer: TDK Corporation; SPL: 70dB; Display_Name: PS1240P02BT; Size: 12.2mmDiax6.5H; BWA PN: SPK-10003-A; Frequency Range: 4kHz; Schematic Symbol: SPEAKER_1; Manufacturer Part Number: PS1240P02BT; Supplier 1: Digi-Key; Supplier Part Number 1: 445-2525-1-ND
Q5 = TRN-10045-A: as Q7 on sheet Servo; Display_Name: FDN335N; BWA PN: TRN-10045-A; Id(max): 1.7A; Vds(max): 20V; Schematic Symbol: MOSFET-N_1; Manufacturer Part Number: FDN335N; Supplier 1: Digi-Key; Supplier Part Number 1: FDN335NCT-ND
R13 = RSH-1K000-D: RES 1.00K OHM 1/10W 1% 0603 SMD; Manufacturer: Yageo; Manufacturer Part Number: RC0603FR-071KL; Power: 0.1W; Display_Name: 1K,1%; Resistance: 1K; Tolerance: 1%; Type: Chip; BWA PN: RSH-1K000-D; Schematic Symbol: RESISTOR_1; Supplier 1: Digi-Key; Supplier Part Number 1: 311-1.00KHRCT-ND
R14 = RSH-1M000-D: as R16 on sheet Servo; Display_Name: 1M,1%; Resistance: 1M; Tolerance: 1%; Type: Chip; BWA PN: RSH-1M000-D; Schematic Symbol: RESISTOR_1; Supplier 1: Digi-Key; Supplier Part Number 1: 311-1.00MHRCT-ND

## Sheet InfraRed.SchDoc: Top Level
size A3; CompanyName: NOT USED; DocumentNumber: 2; SheetNumber: 2; SheetTotal: 10; PageSetup: Record=PageOptions|CenterHorizontal=True|CenterVertical=True|PrintScale=1.00|XCorrection=1.00|YCorrection=1.00|PrintKind=0|BorderSize=5000000|LeftOffset=0|BottomOffset=0|Orientation=2|PaperLength=1000|PaperWidth=1000|Scale=100|PaperSource=7|PrintQuality=-4|MediaType=1|DitherType=10|PaperKind=A3|PrintScaleMode=0
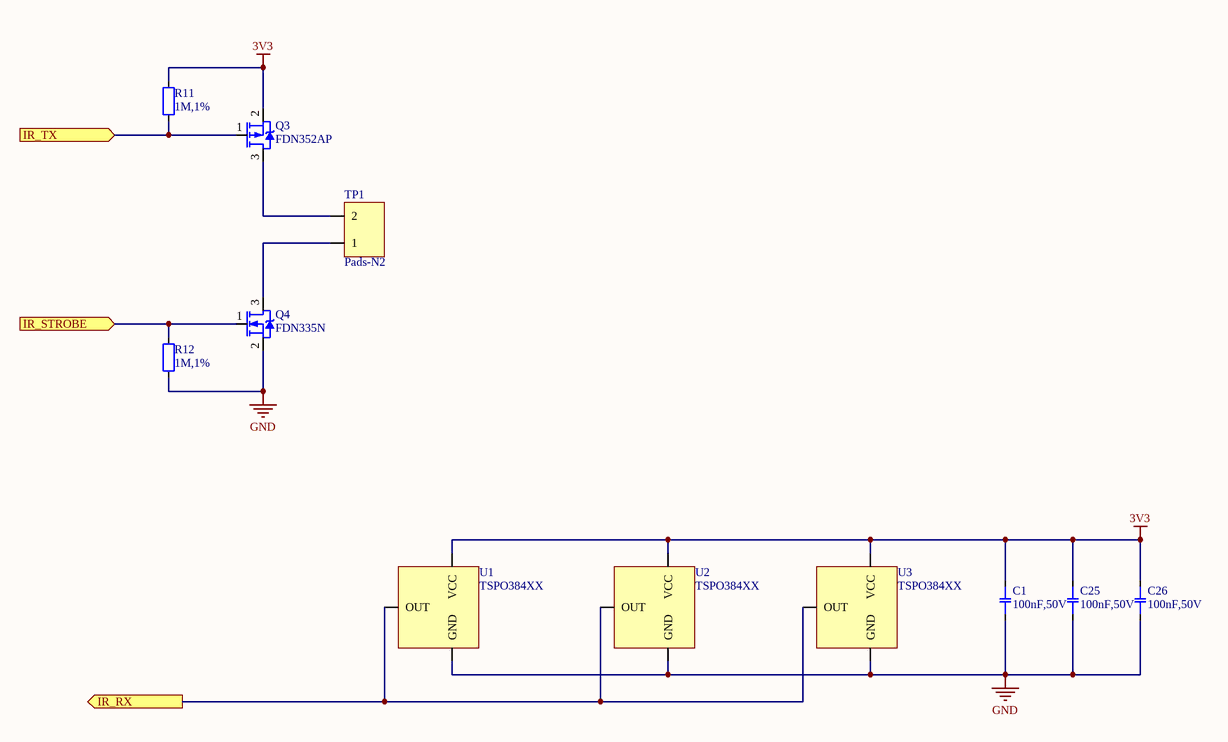
[diagram p8: InfraRed.SchDoc]

### Parts
C1  100nF,50V  [CAPC1608X09N_0603]
C25  100nF,50V  [CAPC1608X09N_0603]
C26  100nF,50V  [CAPC1608X09N_0603]
Q3  FDN352AP  [SOT95P230X110-3N_SOT23]
Q4  FDN335N  [SOT95P230X110-3N_SOT23]
R11  1M,1%  [RESC1608X06N_0603]
R12  1M,1%  [RESC1608X06N_0603]
TP1  Pads-N2  [PADS-N2]
U1  TSPO384XX  [VISHAY_TSOP_]
U2  TSPO384XX  [VISHAY_TSOP_]
U3  TSPO384XX  [VISHAY_TSOP_]

### Ports
IR_RX (out), IR_STROBE (in), IR_TX (in)

### Nets
3V3: C1.1 C25.1 C26.1 Q3.2(S) R11.1 U1.3(VCC) U2.3(VCC) U3.3(VCC)
GND: C1.2 C25.2 C26.2 Q4.2(S) R12.2 U1.2(GND) U2.2(GND) U3.2(GND)
IR_RX: U1.1(OUT) U2.1(OUT) U3.1(OUT) ; port IR_RX
IR_TX: Q3.1(G) R11.2 ; port IR_TX
NetQ3_3: Q3.3(D) TP1.2
NetQ4_1: Q4.1(G) R12.1 ; port IR_STROBE
NetQ4_3: Q4.3(D) TP1.1

### Notes on the sheet
- Project
- Size:
- Date:
- A3
- Revision:
- Sheet
- of
- Lambo
- File:

### Library data of the parts
C1 C25 C26 = CCH-104CH-G: as C22 on sheet Motors; Display_Name: 100nF,50V; Capacitance: 100nF; Dielectric: X7R; Tolerance: 10%; Voltage: 50V; BWA PN: CCH-104CH-G; Schematic Symbol: CAP-NP_1; Supplier 1: Digi-Key; Supplier Part Number 1: 399-5089-1-ND
Q3 = TRN-10006-A: as Q6 on sheet Servo; Display_Name: FDN352AP; BWA PN: TRN-10006-A; Schematic Symbol: MOSFET-P_1; Manufacturer Part Number: FDN352AP; Supplier 1: Digi-Key; Supplier Part Number 1: FDN352APCT-ND
Q4 = TRN-10045-A: as Q7 on sheet Servo; Display_Name: FDN335N; BWA PN: TRN-10045-A; Id(max): 1.7A; Vds(max): 20V; Schematic Symbol: MOSFET-N_1; Manufacturer Part Number: FDN335N; Supplier 1: Digi-Key; Supplier Part Number 1: FDN335NCT-ND
R11 R12 = RSH-1M000-D: as R16 on sheet Servo; Display_Name: 1M,1%; Resistance: 1M; Tolerance: 1%; Type: Chip; BWA PN: RSH-1M000-D; Schematic Symbol: RESISTOR_1; Supplier 1: Digi-Key; Supplier Part Number 1: 311-1.00MHRCT-ND

## Sheet Lights.SchDoc: Top Level
size A3; CompanyName: NOT USED; DocumentNumber: 1; SheetNumber: 1; SheetTotal: 10; PageSetup: Record=PageOptions|CenterHorizontal=True|CenterVertical=True|PrintScale=1.00|XCorrection=1.00|YCorrection=1.00|PrintKind=0|BorderSize=5000000|LeftOffset=0|BottomOffset=0|Orientation=2|PaperLength=1000|PaperWidth=1000|Scale=100|PaperSource=7|PrintQuality=-4|MediaType=1|DitherType=10|PaperKind=A3|PrintScaleMode=0
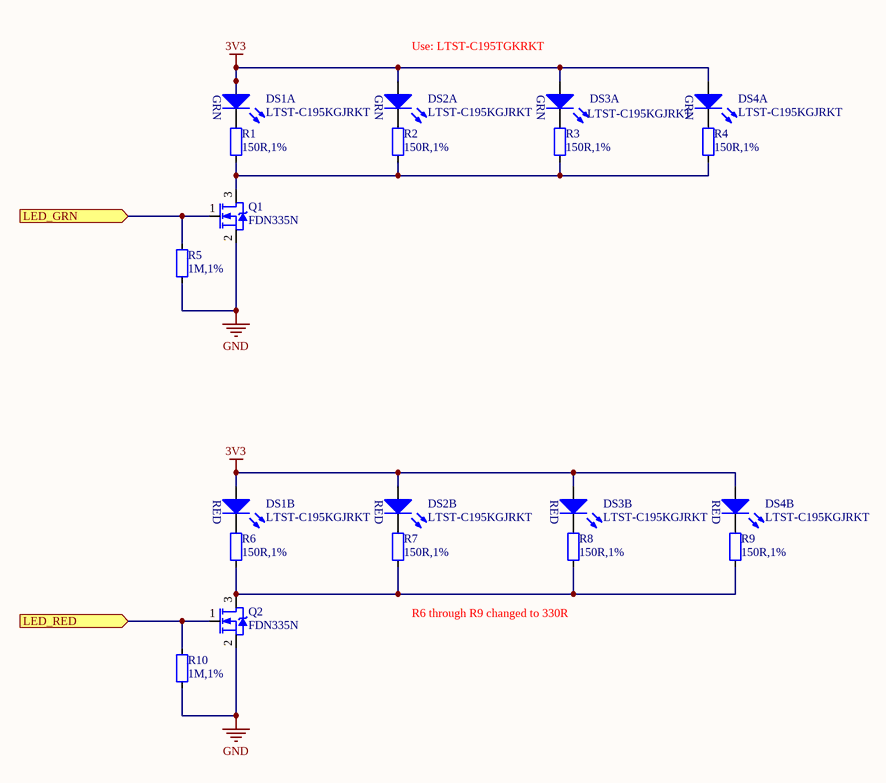
[diagram p9: Lights.SchDoc]

### Parts
DS1  LTST-C195KGJRKT  [LITEON_LTST-C195KGJRKT]  (parts A,B of 2)
DS2  LTST-C195KGJRKT  [LITEON_LTST-C195KGJRKT]  (parts A,B of 2)
DS3  LTST-C195KGJRKT  [LITEON_LTST-C195KGJRKT]  (parts A,B of 2)
DS4  LTST-C195KGJRKT  [LITEON_LTST-C195KGJRKT]  (parts A,B of 2)
Q1  FDN335N  [SOT95P230X110-3N_SOT23]
Q2  FDN335N  [SOT95P230X110-3N_SOT23]
R1  150R,1%  [RESC1608X06N_0603]
R2  150R,1%  [RESC1608X06N_0603]
R3  150R,1%  [RESC1608X06N_0603]
R4  150R,1%  [RESC1608X06N_0603]
R5  1M,1%  [RESC1608X06N_0603]
R6  150R,1%  [RESC1608X06N_0603]
R7  150R,1%  [RESC1608X06N_0603]
R8  150R,1%  [RESC1608X06N_0603]
R9  150R,1%  [RESC1608X06N_0603]
R10  1M,1%  [RESC1608X06N_0603]

### Ports
LED_GRN (in), LED_RED (in)

### Nets
3V3: DS1.1(AG) DS1.2(AR) DS2.1(AG) DS2.2(AR) DS3.1(AG) DS3.2(AR) DS4.1(AG) DS4.2(AR)
GND: Q1.2(S) Q2.2(S) R5.2 R10.2
NetDS1_3: DS1.3(CG) R1.2
NetDS1_4: DS1.4(CR) R6.2
NetDS2_3: DS2.3(CG) R2.2
NetDS2_4: DS2.4(CR) R7.2
NetDS3_3: DS3.3(CG) R3.2
NetDS3_4: DS3.4(CR) R8.2
NetDS4_3: DS4.3(CG) R4.2
NetDS4_4: DS4.4(CR) R9.2
NetQ1_1: Q1.1(G) R5.1 ; port LED_GRN
NetQ1_3: Q1.3(D) R1.1 R2.1 R3.1 R4.1
NetQ2_1: Q2.1(G) R10.1 ; port LED_RED
NetQ2_3: Q2.3(D) R6.1 R7.1 R8.1 R9.1

### Notes on the sheet
- Use: LTST-C195TGKRKT
- R6 through R9 changed to 330R
- Project
- Size:
- Date:
- A3
- Revision:
- Sheet
- of
- Lambo
- File:
- (in symbol LED-10055-A, part A) GRN
- (in symbol LED-10055-A, part B) RED

### Library data of the parts
DS1-DS4 = LED-10055-A: LED GREEN/RED BICOLOR 0606 SMD; Manufacturer: Lite-On Inc; Wavelength: 571,631nm; Axial Intensity: 35,25mcd; Colour: Green,Red; If(max): 20mA; Lens type: Clear; Lens Style/Size: Rectangle with Flat Top, 1.5mm x 1.1mm; Vf@I: 2V,2V@20mA; Viewing Angle: 130°; Vr(max): 5V; Display_Name: LTST-C195KGJRKT; BWA PN: LED-10055-A; Schematic Symbol: LITEON_LTST-C195KGJRKT; Manufacturer Part Number: LTST-C195KGJRKT; Supplier 1: Digi-Key; Supplier Part Number 1: 160-1452-1-ND
Q1 Q2 = TRN-10045-A: as Q7 on sheet Servo; Display_Name: FDN335N; BWA PN: TRN-10045-A; Id(max): 1.7A; Vds(max): 20V; Schematic Symbol: MOSFET-N_1; Manufacturer Part Number: FDN335N; Supplier 1: Digi-Key; Supplier Part Number 1: FDN335NCT-ND
R1-R4 R6-R9 = RSH-150R0-D: RES 150 OHM 1/10W 1% 0603 SMD; Manufacturer: Yageo; Manufacturer Part Number: RC0603FR-07150RL; Power: 0.1W; Display_Name: 150R,1%; Resistance: 150R; Tolerance: 1%; Type: Chip; BWA PN: RSH-150R0-D; Schematic Symbol: RESISTOR_1; Supplier 1: Digi-Key; Supplier Part Number 1: 311-150HRCT-ND
R5 R10 = RSH-1M000-D: as R16 on sheet Servo; Display_Name: 1M,1%; Resistance: 1M; Tolerance: 1%; Type: Chip; BWA PN: RSH-1M000-D; Schematic Symbol: RESISTOR_1; Supplier 1: Digi-Key; Supplier Part Number 1: 311-1.00MHRCT-ND

## Nets that join several sheets
3V3: Motor1 (C23_1.2 U8_1.7 U8_1.8), Motor2 (C23_2.2 U8_2.7 U8_2.8), Radio (5 pins), Power (9 pins), MCU (8 pins), LIS2 (C2.2 U4.7 U4.8), Buzzer (LS1.1 R13.2), InfraRed (8 pins), Lights (8 pins)
GND: Motor1 (C22_1.1 C23_1.1 U8_1.4 U8_1.9), Motor2 (C22_2.1 C23_2.1 U8_2.4 U8_2.9), Radio (19 pins), Power (10 pins), MCU (9 pins), Servo (A1.1 C24.1 Q7.2 R25.2), LIS2 (7 pins), Buzzer (Q5.2 R14.2), InfraRed (8 pins), Lights (Q1.2 Q2.2 R5.2 R10.2)
VBAT: Motor1 (C22_1.2 U8_1.1), Motor2 (C22_2.2 U8_2.1), Power (6 pins), Servo (Q6.2 R15.1 R16.2)
IR_RX: MCU (J1.4 U6.20), InfraRed (U1.1 U2.1 U3.1)
IR_TX: MCU (J1.5 U6.19), InfraRed (Q3.1 R11.2)
NetD1_2: Power (D1.2), MCU (U6.11)
NetQ1_1: MCU (U6.2), Lights (Q1.1 R5.1)
NetQ2_1: MCU (U6.3), Lights (Q2.1 R10.1)
NetQ4_1: MCU (U6.13), InfraRed (Q4.1 R12.1)
NetQ5_1: MCU (U6.12), Buzzer (Q5.1 R14.1)
NetQ7_1: MCU (U6.21), Servo (Q7.1 R25.1)
NetR17_2: MCU (U6.22), Servo (R17.2)
NetR18_1: Power (R18.1 R19.2), MCU (U6.18)
NetR20_1: Power (R20.1 R21.1), MCU (U6.10)
NetU4_1: Radio (U7.1), MCU (U6.26), LIS2 (U4.1)
NetU4_2: Radio (U7.20), MCU (U6.28), LIS2 (U4.2)
NetU4_3: Radio (U7.2), MCU (U6.27), LIS2 (U4.3)
NetU4_4: MCU (U6.29), LIS2 (U4.4)
NetU4_6: MCU (U6.30), LIS2 (U4.6)
NetU5_4: Power (U5.4), MCU (U6.25)
NetU6_6: Motor2 (U8_2.6), MCU (U6.6)
NetU6_7: Motor2 (U8_2.5), MCU (U6.7)
NetU6_8: Motor1 (U8_1.6), MCU (U6.8)
NetU6_9: Motor1 (U8_1.5), MCU (U6.9)
NetU6_14: Radio (U7.6), MCU (U6.14)
NetU6_15: Radio (U7.7), MCU (U6.15)

## Assembly variants
Default: not fitted J2 J3